# EAGLE schematic untitled (EAGLE 8.0.1)
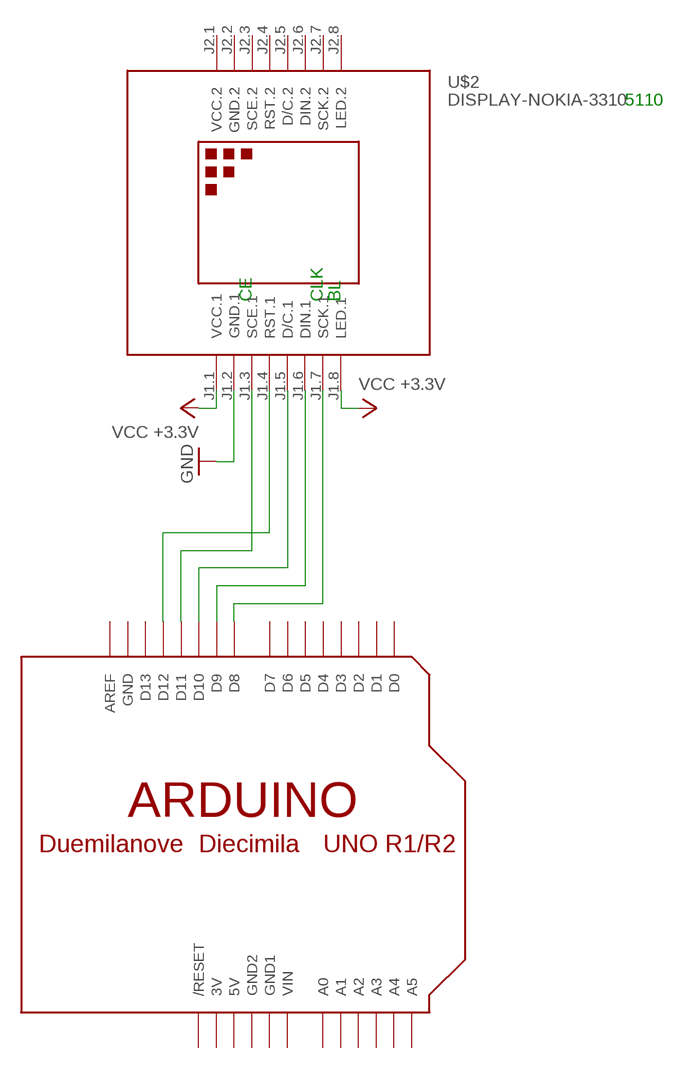
[diagram p0: schematic, sheet 1]

## Parts
U$1  ARDUINOUNO  [ARDUINO]
U$2  DISPLAY-NOKIA-3310  [DISPLAY-NOKIA-3310]

## Nets
GND: U$2.J1.2(GND.1)
N$2: U$1.D8 U$2.J1.7(SCK.1)
N$3: U$1.D9 U$2.J1.6(DIN.1)
N$4: U$1.D10 U$2.J1.5(D/C.1)
N$5: U$1.D11 U$2.J1.3(SCE.1)
N$6: U$1.D12 U$2.J1.4(RST.1)
VCC: U$2.J1.1(VCC.1) U$2.J1.8(LED.1) ; supply symbol labelled VCC +3.3V
Unconnected: U$1.A0 U$1.A1 U$1.A2 U$1.A3 U$1.A4 U$1.A5 U$1.AREF U$1.D0 U$1.D1 U$1.D2 U$1.D3 U$1.D4 U$1.D5 U$1.D6 U$1.D7 U$1.D13 U$1.RESET(/RESET) U$2.J2.3(SCE.2) U$2.J2.4(RST.2) U$2.J2.5(D/C.2) U$2.J2.6(DIN.2) U$2.J2.7(SCK.2) U$2.J2.8(LED.2)

## Notes on the sheet
- 5110
- CE | CLK | BL

## Power pins joined to a net without a drawn wire
3V: U$1.3V
5V: U$1.5V
GND: U$1.GND
GND1: U$1.GND1
GND2: U$1.GND2
GND.2: U$2.J2.2(GND.2)
VCC.2: U$2.J2.1(VCC.2)
VIN: U$1.VIN

## Library data of the parts
U$1 = adafruit:ARDUINO: Arduino Diecimila/Duemilanove Make a shield with ease, this package has all the named pins as well as the two mounting drill holes and an outline of the USB and DC power connector. The outline is on the DIMENSION layer, so if your board house uses it they will cut the outline to match. http://www.ladyada.net/library/pcb/eaglelibrary.html
U$2 = diy-modules:DISPLAY-NOKIA-3310: 84x48 Dot Matrix LCD Module based on Nokia 3310 display More details available here: https://arduinoandsoftware.wordpress.com/2012/12/30/nokia-33105110-3-3v-display-with-5v-arduino/